# EAGLE design mainboard (EAGLE 5.10)
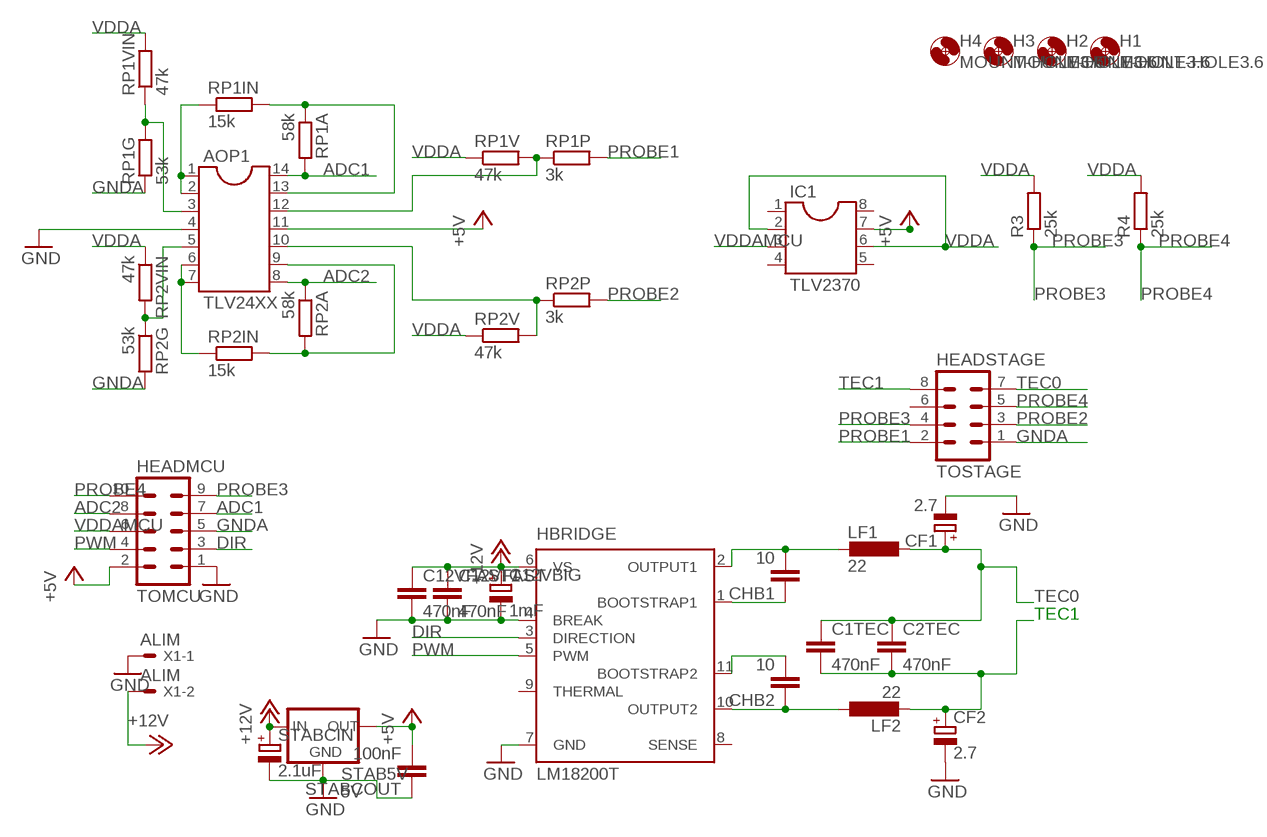
[diagram p0: schematic, sheet 1]

## Parts
AOP1  TLV24XX  DIL14  [DIL14]
C1TEC  470nF  C-EU050-035X075  [C050-035X075]
C2TEC  470nF  C-EU050-035X075  [C050-035X075]
C12VBIG  1mF  CPOL-EUE3.5-10  [E3,5-10]
C12VFAST  470nF  C-EU050-025X075  [C050-025X075]
C12VFAST1  470nF  C-EU050-025X075  [C050-025X075]
CF1  2.7  CPOL-EUE2-5  [E2-5]
CF2  2.7  CPOL-EUE2-5  [E2-5]
CHB1  10  C-EU050-025X075  [C050-025X075]
CHB2  10  C-EU050-025X075  [C050-025X075]
H1  MOUNT-HOLE3.6  [3,6]
H2  MOUNT-HOLE3.6  [3,6]
H3  MOUNT-HOLE3.6  [3,6]
H4  MOUNT-HOLE3.6  [3,6]
HBRIDGE  LM18200T  [TO-220-11]
HEADMCU  TOMCU  MA05-2  [MA05-2]
HEADSTAGE  TOSTAGE  MA04-2  [MA04-2]
IC1  TLV2370  DIL8  [DIL08]
LF1  22  LMURATA  [LCUSTMURATA]
LF2  22  LMURATA  [LCUSTMURATA]
R3  25k  R-EU_0207/10  [0207/10]
R4  25k  R-EU_0207/10  [0207/10]
RP1A  58k  R-EU_0207/10  [0207/10]
RP1G  53k  R-EU_0207/10  [0207/10]
RP1IN  15k  R-EU_0207/10  [0207/10]
RP1P  3k  R-EU_0207/10  [0207/10]
RP1V  47k  R-EU_0207/10  [0207/10]
RP1VIN  47k  R-EU_0207/10  [0207/10]
RP2A  58k  R-EU_0207/10  [0207/10]
RP2G  53k  R-EU_0207/10  [0207/10]
RP2IN  15k  R-EU_0207/10  [0207/10]
RP2P  3k  R-EU_0207/10  [0207/10]
RP2V  47k  R-EU_0207/10  [0207/10]
RP2VIN  47k  R-EU_0207/10  [0207/10]
STAB5V  5V  78XXS  [78XXS]
STABCIN  2.1uF  CPOL-EUE2.5-7  [E2,5-7]
STABCOUT  100nF  C-EU050-025X075  [C050-025X075]
X1  ALIM  KK-156-2  [KK-156-2]

## Nets
+5V: AOP1.11 HEADMCU.2 IC1.7 STAB5V.OUT STABCOUT.2
+12V: C12VBIG.+ C12VFAST1.1 C12VFAST.1 HBRIDGE.6(VS) STAB5V.IN STABCIN.+ X1.2
ADC1: AOP1.14 HEADMCU.7 RP1A.2
ADC2: AOP1.8 HEADMCU.8 RP2A.1
BOOSTRAP1: CHB1.1 HBRIDGE.1(BOOTSTRAP1)
DIR: HBRIDGE.3(DIRECTION) HEADMCU.3
GND: AOP1.4 C12VBIG.- C12VFAST1.2 C12VFAST.2 CF1.- CF2.- HBRIDGE.4(BREAK) HBRIDGE.7(GND) HEADMCU.1 STAB5V.GND STABCIN.- STABCOUT.1 X1.1
GNDA: HEADMCU.5 HEADSTAGE.1 RP1G.1 RP2G.2
N$2: CHB1.2 HBRIDGE.2(OUTPUT1) LF1.2
N$3: AOP1.3 RP1G.2 RP1VIN.1
N$5: CHB2.2 HBRIDGE.11(BOOTSTRAP2)
N$6: CHB2.1 HBRIDGE.10(OUTPUT2) LF2.1
N$14: AOP1.9 RP2A.2 RP2IN.2
N$15: AOP1.6 AOP1.7 RP2IN.1
N$16: AOP1.12 RP1P.1 RP1V.2
N$18: AOP1.5 RP2G.1 RP2VIN.2
N$26: AOP1.10 RP2P.1 RP2V.2
PROBE1: HEADSTAGE.2 RP1P.2
PROBE2: HEADSTAGE.3 RP2P.2
PROBE3: HEADMCU.9 HEADSTAGE.4 R3.1
PROBE4: HEADMCU.10 HEADSTAGE.5 R4.1
PWM: HBRIDGE.5(PWM) HEADMCU.4
RP1A: AOP1.13 RP1A.1 RP1IN.2
RP1IN: AOP1.1 AOP1.2 RP1IN.1
TEC0: C1TEC.1 C2TEC.1 CF1.+ HEADSTAGE.7 LF1.1
TEC1: C1TEC.2 C2TEC.2 CF2.+ HEADSTAGE.8 LF2.2
VDDA: IC1.2 IC1.6 R3.2 R4.2 RP1V.1 RP1VIN.2 RP2V.1 RP2VIN.1
VDDAMCU: HEADMCU.6 IC1.3
Unconnected: HBRIDGE.8(SENSE) HBRIDGE.9(THERMAL) HEADSTAGE.6 IC1.1 IC1.4 IC1.5 IC1.8

## Library data of the parts
AOP1 = ic-package:DIL14: Dual In Line / Socket
C1TEC C2TEC C12VFAST C12VFAST1 CHB1 CHB2 STABCOUT = resistor:C-EU: CAPACITOR, European symbol
C12VBIG CF1 CF2 = resistor:CPOL-EU: POLARIZED CAPACITOR, European symbol
H1-H4 = holes:MOUNT-HOLE: MOUNTING HOLE with drill center marker
HBRIDGE = national-semiconductor:LM18200T: 3A, 55V H-Bridge Motor Control SourcE: http://cache.national.com/ds/LM/LMD18200.pdf
HEADMCU = con-lstb:MA05-2: PIN HEADER
HEADSTAGE = con-lstb:MA04-2: PIN HEADER
IC1 = ic-package:DIL8: Dual In Line / Socket
LF1 LF2 = custom:LMURATA
R3 R4 RP1A RP1G RP1IN RP1P RP1V RP1VIN RP2A RP2G RP2IN RP2P RP2V RP2VIN = resistor:R-EU_: RESISTOR, European symbol
STAB5V = v-reg:78XXS: VOLTAGE REGULATOR
STABCIN = rcl:CPOL-EU: POLARIZED CAPACITOR, European symbol
X1 = con-molex:KK-156-2: KK 156 HEADER Source: http://www.molex.com/pdm_docs/sd/026604100_sd.pdf

## Board
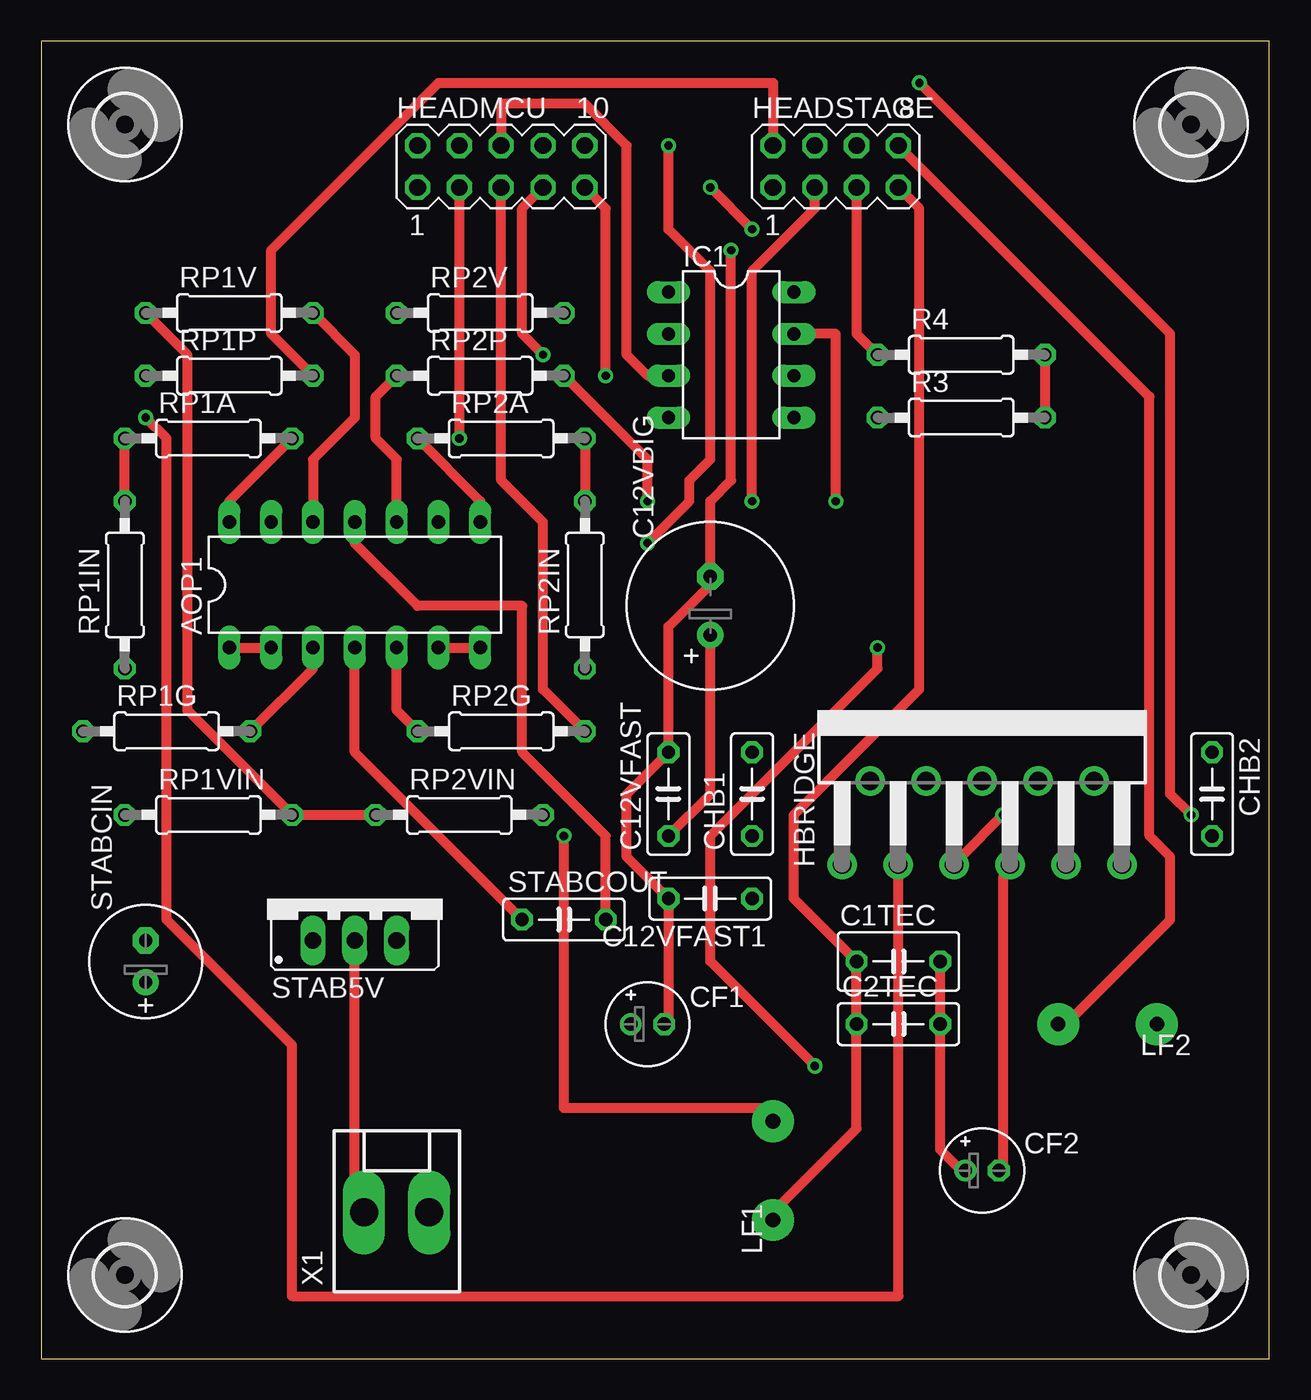
[diagram p1: board, top side]
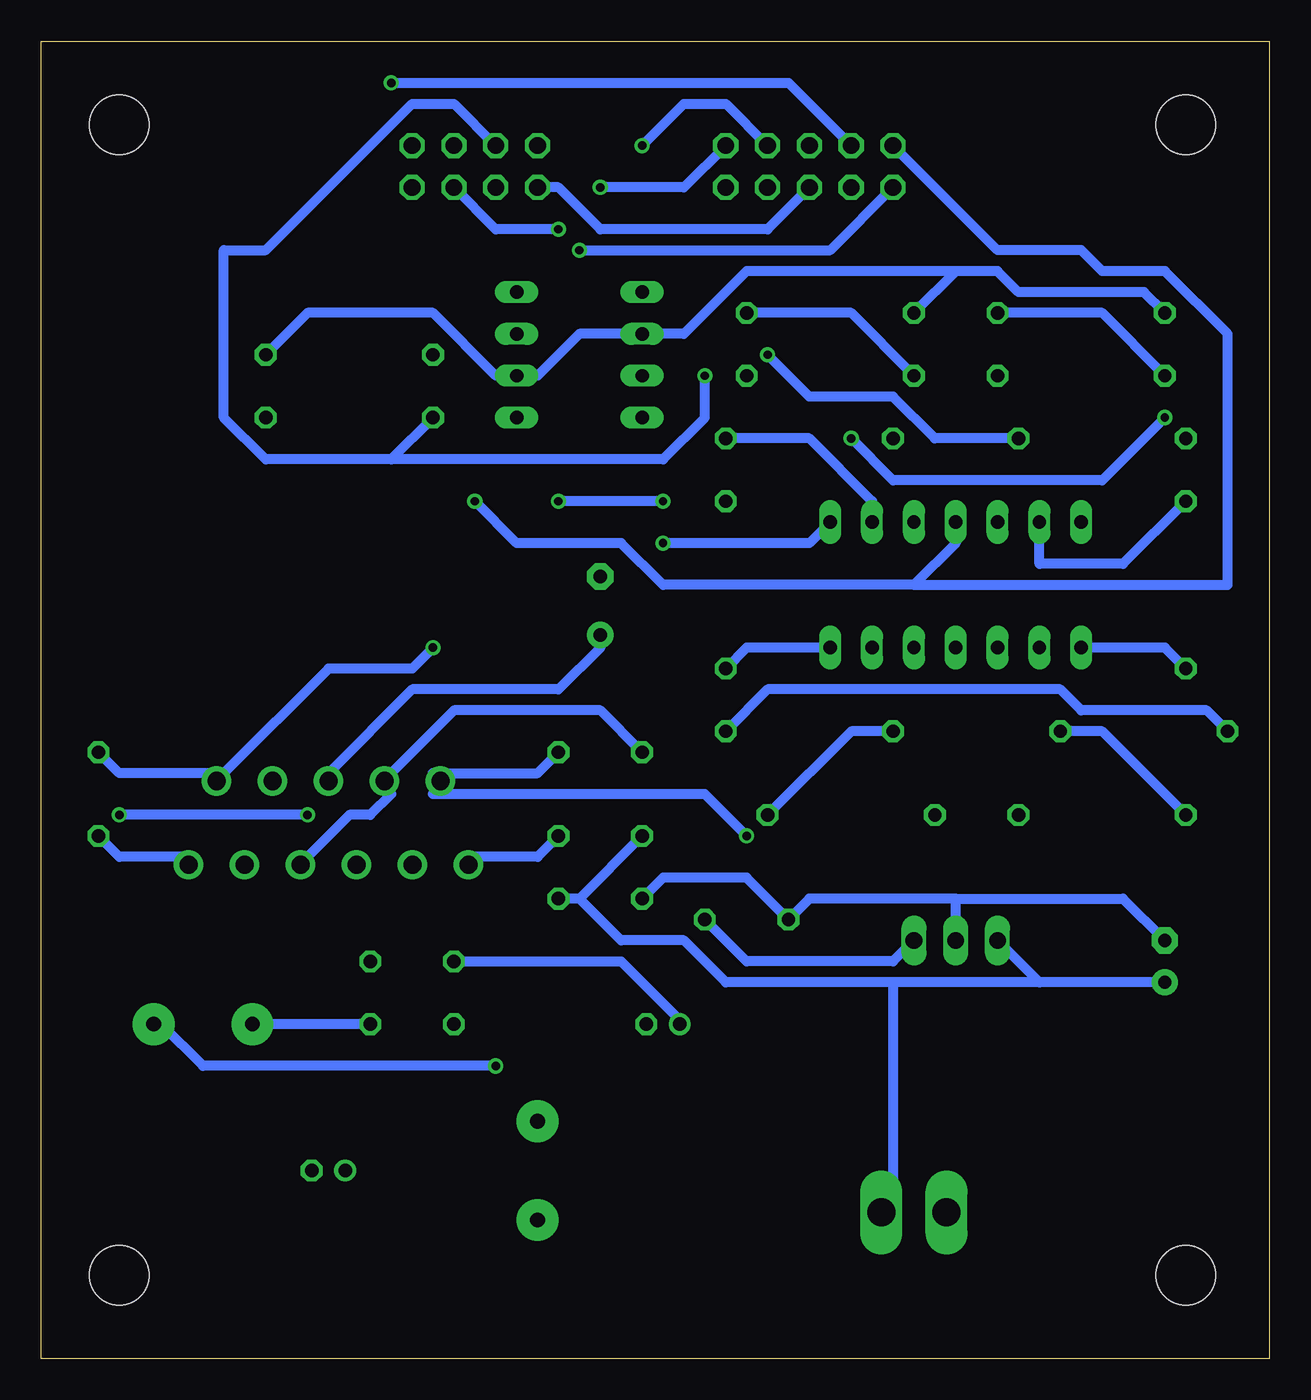
[diagram p2: board, bottom side, seen from below]

Size 74.6 x 80 mm. Coordinates in mm from the lower left corner, seen from the top.
Outline: 0,0 74.6,0 74.6,80 0,80 0,0
Copper layers (1*16): Top 0.035mm / dielectric 1.5mm / Bottom 0.035mm
Design rules "default *": minimum track width 24mil, minimum drill 20mil, track to track 24mil, track to pad 24mil, pad to pad 24mil, via to via 24mil, smd to smd 8mil, copper to edge 40mil, drill to drill 8mil, minimum pad ring 10mil, minimum via ring 8mil, stop-mask expansion 4mil, vias tented up to drill 0mil, thermal gap 10mil

### Footprints (pad centres in the part's own frame; a part is rotated, then mirrored left to right if it is on the bottom)
DIL14 = drill 0.813 long: 1 -7.62,-3.81; 2 -5.08,-3.81; 3 -2.54,-3.81; 4 0,-3.81; 5 2.54,-3.81; 6 5.08,-3.81; 7 7.62,-3.81; 8 7.62,3.81; 9 5.08,3.81; 10 2.54,3.81; 11 0,3.81; 12 -2.54,3.81; 13 -5.08,3.81; 14 -7.62,3.81
C050-035X075 = drill 0.813 octagon: 1 -2.54,0; 2 2.54,0
C050-025X075 = drill 0.813 octagon: 1 -2.54,0; 2 2.54,0
E3,5-10 = drill 0.813 pad 1.6 round: + -1.778,0 | drill 0.813 pad 1.6 octagon: - 1.778,0
E2-5 = drill 0.813 pad 1.27 round: + -1.016,0 | drill 0.813 pad 1.27 octagon: - 1.016,0
3,6 = hole 3.6: 0,0
TO-220-11 = drill 1.1 pad 1.778 round: 1 -8.5,-9.37; 2 -6.8,-4.29; 3 -5.1,-9.37; 4 -3.4,-4.29; 5 -1.7,-9.37; 6 0,-4.29; 7 1.7,-9.37; 8 3.4,-4.29; 9 5.1,-9.37; 10 6.8,-4.29; 11 8.5,-9.37
MA05-2 = drill 1.016 octagon: 1 -5.08,-1.27; 2 -5.08,1.27; 3 -2.54,-1.27; 4 -2.54,1.27; 5 0,-1.27; 6 0,1.27; 7 2.54,-1.27; 8 2.54,1.27; 9 5.08,-1.27; 10 5.08,1.27
MA04-2 = drill 1.016 octagon: 1 -3.81,-1.27; 2 -3.81,1.27; 3 -1.27,-1.27; 4 -1.27,1.27; 5 1.27,-1.27; 6 1.27,1.27; 7 3.81,-1.27; 8 3.81,1.27
DIL08 = drill 0.813 long: 1 -3.81,-3.81; 2 -1.27,-3.81; 3 1.27,-3.81; 4 3.81,-3.81; 5 3.81,3.81; 6 1.27,3.81; 7 -1.27,3.81; 8 -3.81,3.81
LCUSTMURATA = drill 0.889 pad 2.54 round: 1 -2.997,0; 2 2.997,0
0207/10 = drill 0.813 octagon: 1 -5.08,0; 2 5.08,0
78XXS = drill 1.016 long: GND 0,-2.54; IN -2.54,-2.54; OUT 2.54,-2.54
E2,5-7 = drill 0.813 pad 1.6 round: + -1.27,0 | drill 0.813 pad 1.6 octagon: - 1.27,0
KK-156-2 = drill 1.7 pad 2.184 long: 1 -1.98,0; 2 1.98,0

### Placement (x,y rotation side)
AOP1  19.05,46.99 0 top
C1TEC  52.07,24.13 0 top
C2TEC  470nF  [C050-025X075]  52.07,20.32 0 top
C12VBIG  40.64,45.72 90 top
C12VFAST  38.1,34.29 90 top
C12VFAST1  40.64,27.94 180 top
CF1  36.83,20.32 0 top
CF2  57.15,11.43 0 top
CHB1  43.18,34.29 90 top
CHB2  71.12,34.29 270 top
H1  5.08,74.93 0 top
H2  69.85,74.93 0 top
H3  69.85,5.08 0 top
H4  5.08,5.08 0 top
HBRIDGE  57.15,39.37 0 top
HEADMCU  27.94,72.39 0 top
HEADSTAGE  48.26,72.39 0 top
IC1  41.91,60.96 270 top
LF1  44.45,11.43 90 top
LF2  64.77,20.32 180 top
R3  55.88,57.15 0 top
R4  55.88,60.96 0 top
RP1A  10.16,55.88 0 top
RP1G  7.62,38.1 0 top
RP1IN  5.08,46.99 90 top
RP1P  11.43,59.69 0 top
RP1V  11.43,63.5 0 top
RP1VIN  10.16,33.02 0 top
RP2A  27.94,55.88 0 top
RP2G  27.94,38.1 0 top
RP2IN  33.02,46.99 90 top
RP2P  26.67,59.69 0 top
RP2V  26.67,63.5 0 top
RP2VIN  25.4,33.02 0 top
STAB5V  19.05,27.94 0 top
STABCIN  6.35,24.13 90 top
STABCOUT  31.75,26.67 0 top
X1  21.59,8.89 0 top

### Tracks (layer width: path | path; a pad name or v marks a point on that pad's centre or on a via)
+5V  (via drill 0.51)
  Top 0.61: AOP1.11 19.05,49.53 22.86,45.72 29.21,45.72 29.21,36.83 34.29,31.75 STABCOUT.2 | IC1.7 48.26,62.23 v48.26,52.07
  Bottom 0.61: STABCOUT.2 31.75,24.13 22.86,24.13 STAB5V.OUT | v48.26,52.07 45.72,49.53 39.37,49.53 36.83,46.99 21.59,46.99 | 21.59,46.99 19.05,49.53 AOP1.11 | HEADMCU.2 16.51,67.31 11.43,67.31 10.16,66.04 6.35,66.04 2.54,62.23 2.54,46.99 21.59,46.99
+12V
  Top 0.61: C12VFAST.1 40.64,34.29 C12VBIG.+
  Bottom 0.61: 41.91,27.94 C12VFAST.1 | 41.91,27.94 C12VFAST1.1 | HBRIDGE.6 57.15,35.56 52.07,40.64 43.18,40.64 40.64,43.18 C12VBIG.+ | 13.97,22.86 STAB5V.IN | STABCIN.+ 13.97,22.86 | 22.86,22.86 22.86,8.89 X1.2 | 13.97,22.86 22.86,22.86 | 41.91,27.94 39.37,25.4 35.56,25.4 33.02,22.86 22.86,22.86
ADC1  (via drill 0.51)
  Top 0.61: AOP1.14 11.43,52.07 RP1A.2 | HEADMCU.7 29.21,69.85 29.21,62.23 v30.48,60.96
  Bottom 0.61: v30.48,60.96 27.94,58.42 22.86,58.42 20.32,55.88 RP1A.2
ADC2  (via drill 0.51)
  Top 0.61: RP2A.1 26.67,52.07 AOP1.8 | v38.1,73.66 38.1,68.58 40.64,66.04 40.64,54.61 39.37,53.34 39.37,52.07 v36.83,49.53
  Bottom 0.61: HEADMCU.8 33.02,76.2 35.56,76.2 v38.1,73.66 | v36.83,49.53 27.94,49.53 AOP1.8
BOOSTRAP1
  Bottom 0.61: CHB1.1 44.45,30.48 48.26,30.48 HBRIDGE.1
DIR  (via drill 0.51)
  Top 0.61: v25.4,55.88 HEADMCU.3 | v6.35,57.15 7.62,55.88 7.62,26.67 15.24,19.05 15.24,3.81 52.07,3.81 52.07,29.21 HBRIDGE.3
  Bottom 0.61: v25.4,55.88 22.86,53.34 10.16,53.34 v6.35,57.15
GND  (via drill 0.51)
  Top 0.61: v41.91,67.31 41.91,53.34 40.64,52.07 C12VBIG.- 40.64,46.99 38.1,44.45 C12VFAST.2 35.56,34.29 35.56,30.48 C12VFAST1.2 38.1,20.32 CF1.- | CF2.- 58.42,11.43 58.42,29.21 HBRIDGE.7 | STAB5V.GND 19.05,8.89 X1.1 | STABCOUT.1 19.05,36.83 AOP1.4
  Bottom 0.61: HEADMCU.1 26.67,67.31 v41.91,67.31 | HBRIDGE.7 58.42,30.48 55.88,33.02 54.61,33.02 53.34,34.29 HBRIDGE.4 53.34,35.56 49.53,39.37 40.64,39.37 C12VFAST.2 | STABCIN.- 8.89,27.94 19.05,27.94 | 19.05,27.94 27.94,27.94 STABCOUT.1 31.75,29.21 36.83,29.21 C12VFAST1.2 | STAB5V.GND 19.05,27.94
GNDA
  Top 0.61: HEADMCU.5 27.94,53.34 30.48,50.8 30.48,40.64 RP2G.2
  Bottom 0.61: HEADMCU.5 30.48,68.58 40.64,68.58 43.18,71.12 HEADSTAGE.1 | RP1G.1 3.81,39.37 11.43,39.37 12.7,40.64 30.48,40.64 RP2G.2
N$2  (via drill 0.51)
  Top 0.61: v31.75,31.75 31.75,15.24 44.45,15.24 LF1.2
  Bottom 0.61: CHB1.2 44.45,35.56 50.8,35.56 HBRIDGE.2 50.8,34.29 34.29,34.29 v31.75,31.75
N$3
  Top 0.61: AOP1.3 16.51,41.91 RP1G.2
  Bottom 0.61: RP1VIN.1 10.16,38.1 RP1G.2
N$5
  Bottom 0.61: CHB2.2 69.85,30.48 66.04,30.48 HBRIDGE.11
N$6  (via drill 0.51)
  Top 0.61: v46.99,17.78 40.64,24.13 40.64,31.75 50.8,41.91 v50.8,43.18
  Bottom 0.61: CHB2.1 69.85,35.56 63.5,35.56 | v46.99,17.78 64.77,17.78 67.31,20.32 LF2.1 | v50.8,43.18 52.07,41.91 57.15,41.91 63.5,35.56 | 63.5,35.56 HBRIDGE.10
N$14
  Top 0.61: RP2A.2 RP2IN.2
  Bottom 0.61: AOP1.9 24.13,52.07 27.94,55.88 RP2A.2
N$15
  Top 0.61: AOP1.6 AOP1.7
  Bottom 0.61: RP2IN.1 31.75,43.18 AOP1.7
N$16
  Top 0.61: AOP1.12 16.51,54.61 19.05,57.15 19.05,60.96 RP1V.2
  Bottom 0.61: RP1P.1 10.16,63.5 RP1V.2
N$18
  Top 0.61: RP2G.1 21.59,39.37 AOP1.5
  Bottom 0.61: RP2VIN.2 25.4,38.1 RP2G.1
N$26
  Top 0.61: AOP1.10 21.59,54.61 20.32,55.88 20.32,58.42 RP2P.1
  Bottom 0.61: RP2V.2 25.4,63.5 RP2P.1
PROBE1
  Top 0.61: RP1P.2 13.97,62.23 13.97,67.31 24.13,77.47 44.45,77.47 HEADSTAGE.2
PROBE2  (via drill 0.51)
  Top 0.61: RP2P.2 36.83,54.61 v36.83,52.07 | v43.18,52.07 43.18,66.04 46.99,69.85 HEADSTAGE.3
  Bottom 0.61: v36.83,52.07 v43.18,52.07
PROBE3  (via drill 0.51)
  Top 0.61: HEADMCU.9 34.29,69.85 v34.29,59.69
  Bottom 0.61: 53.34,54.61 R3.1 | 53.34,54.61 60.96,54.61 63.5,57.15 63.5,67.31 60.96,67.31 52.07,76.2 49.53,76.2 HEADSTAGE.4 | v34.29,59.69 34.29,57.15 36.83,54.61 53.34,54.61
PROBE4  (via drill 0.51)
  Top 0.61: R4.1 49.53,62.23 HEADSTAGE.5 | v40.64,71.12 v43.18,68.58
  Bottom 0.61: HEADMCU.10 35.56,71.12 v40.64,71.12 | v43.18,68.58 46.99,68.58 HEADSTAGE.5
PWM  (via drill 0.51)
  Top 0.61: v53.34,77.47 68.58,62.23 68.58,34.29 v69.85,33.02 | v58.42,33.02 55.88,30.48 HBRIDGE.5
  Bottom 0.61: HEADMCU.4 29.21,77.47 v53.34,77.47 | v58.42,33.02 v69.85,33.02
RP1A
  Top 0.61: RP1IN.2 RP1A.1
  Bottom 0.61: AOP1.13 13.97,48.26 8.89,48.26 RP1IN.2
RP1IN
  Top 0.61: AOP1.1 AOP1.2
  Bottom 0.61: RP1IN.1 6.35,43.18 AOP1.1
TEC0
  Top 0.61: HEADSTAGE.7 53.34,69.85 53.34,40.64 45.72,33.02 45.72,27.94 C1TEC.1 C2TEC.1 49.53,13.97 44.45,8.89 LF1.1
  Bottom 0.61: C1TEC.1 39.37,24.13 35.56,20.32 CF1.+
TEC1
  Top 0.61: C1TEC.2 C2TEC.2 54.61,12.7 55.88,11.43 CF2.+ | HEADSTAGE.8 67.31,58.42 67.31,31.75 68.58,30.48 68.58,26.67 62.23,20.32 LF2.2
  Bottom 0.61: C2TEC.2 LF2.2
VDDA
  Top 0.61: R4.2 R3.2 | RP2VIN.1 RP1VIN.2 8.89,39.37 8.89,60.96 RP1V.1
  Bottom 0.61: R4.2 58.42,63.5 50.8,63.5 46.99,59.69 IC1.6 44.45,59.69 41.91,62.23 IC1.2 35.56,62.23 31.75,66.04 19.05,66.04 | RP1V.1 7.62,64.77 15.24,64.77 16.51,66.04 19.05,66.04 | 19.05,66.04 RP2V.1
VDDAMCU
  Top 0.61: IC1.3 36.83,59.69 35.56,60.96 35.56,73.66 33.02,76.2 27.94,76.2 HEADMCU.6